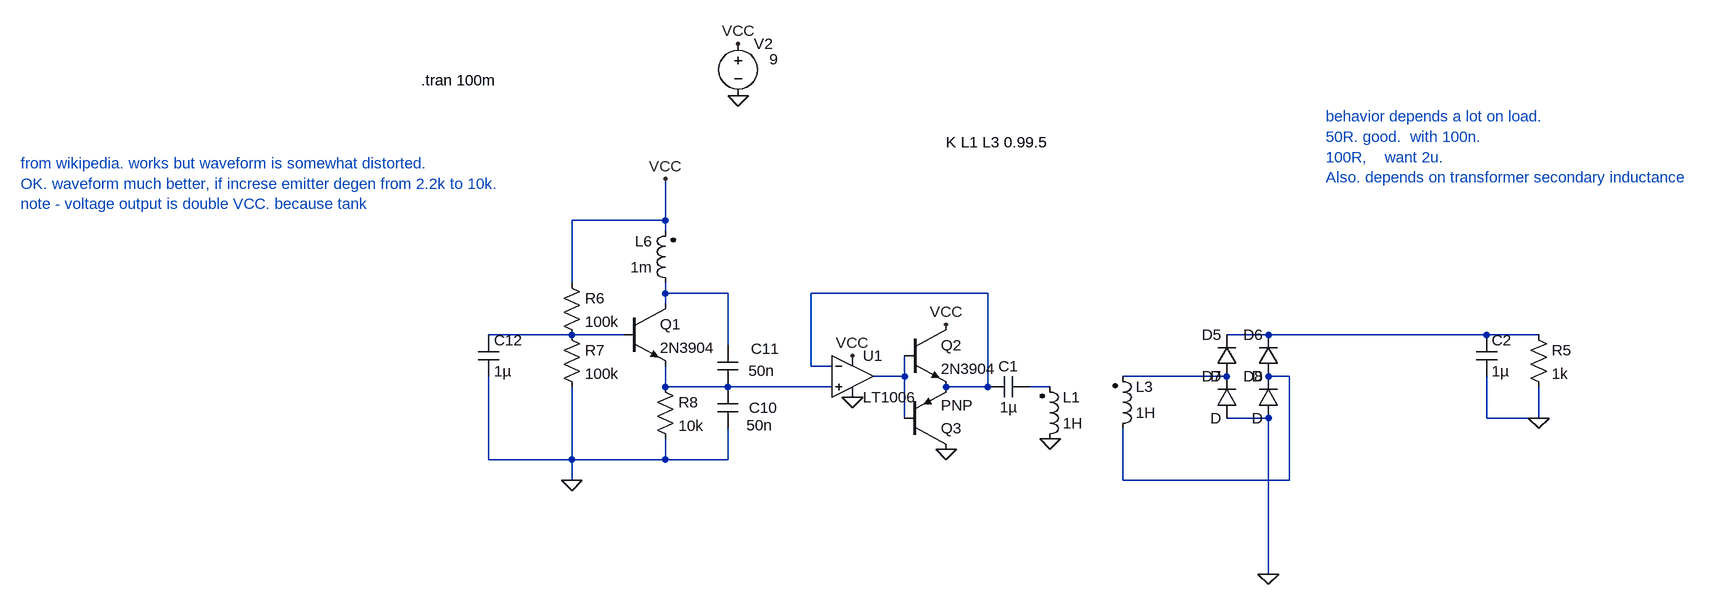
[diagram p0: schematic Draft105.asc]
Draft105.asc, the LTspice schematic file:
Version 4
SHEET 1 5720 1740
WIRE -992 -288 -992 -352
WIRE -992 -288 -1136 -288
WIRE -992 -272 -992 -288
WIRE -1136 -192 -1136 -288
WIRE -992 -176 -992 -192
WIRE -896 -176 -992 -176
WIRE -496 -176 -768 -176
WIRE -992 -160 -992 -176
WIRE -1136 -112 -1264 -112
WIRE -1056 -112 -1136 -112
WIRE -64 -112 -128 -112
WIRE 272 -112 -64 -112
WIRE 352 -112 272 -112
WIRE -896 -96 -896 -176
WIRE -768 -64 -768 -176
WIRE -736 -64 -768 -64
WIRE -624 -48 -624 -80
WIRE -624 -48 -672 -48
WIRE -128 -48 -288 -48
WIRE -32 -48 -64 -48
WIRE -992 -32 -992 -64
WIRE -896 -32 -992 -32
WIRE -736 -32 -896 -32
WIRE -496 -32 -496 -176
WIRE -496 -32 -560 -32
WIRE -400 -32 -432 -32
WIRE -624 16 -624 -48
WIRE -64 16 -128 16
WIRE 272 16 272 -48
WIRE 352 16 352 -32
WIRE 352 16 272 16
WIRE -1264 80 -1264 -48
WIRE -1136 80 -1136 -32
WIRE -1136 80 -1264 80
WIRE -992 80 -992 48
WIRE -992 80 -1136 80
WIRE -896 80 -896 32
WIRE -896 80 -992 80
WIRE -1136 112 -1136 80
WIRE -288 112 -288 32
WIRE -32 112 -32 -48
WIRE -32 112 -288 112
WIRE -64 256 -64 16
FLAG -880 -480 0
FLAG -880 -560 VCC
FLAG 352 16 0
FLAG -64 256 0
FLAG -992 -352 VCC
FLAG -1136 112 0
FLAG -400 48 0
FLAG -704 -80 VCC
FLAG -560 -128 VCC
FLAG -704 -16 0
FLAG -560 64 0
SYMBOL voltage -880 -576 R0
WINDOW 123 0 0 Left 0
WINDOW 39 0 0 Left 0
WINDOW 3 48 40 Left 2
SYMATTR Value 9
SYMATTR InstName V2
SYMBOL ind2 -304 48 M180
WINDOW 0 36 80 Left 2
WINDOW 3 36 40 Left 2
SYMATTR InstName L3
SYMATTR Value 1H
SYMATTR Type ind
SYMBOL diode -112 -48 R180
WINDOW 0 24 64 Left 2
WINDOW 3 24 0 Left 2
SYMATTR InstName D5
SYMBOL diode -48 -48 R180
WINDOW 0 24 64 Left 2
WINDOW 3 24 0 Left 2
SYMATTR InstName D6
SYMBOL diode -112 16 R180
WINDOW 0 24 64 Left 2
WINDOW 3 24 0 Left 2
SYMATTR InstName D7
SYMBOL diode -48 16 R180
WINDOW 0 24 64 Left 2
WINDOW 3 24 0 Left 2
SYMATTR InstName D8
SYMBOL cap 256 -112 R0
SYMATTR InstName C2
SYMATTR Value 1µ
SYMBOL res 336 -128 R0
SYMATTR InstName R5
SYMATTR Value 1k
SYMBOL ind2 -976 -176 R180
WINDOW 0 36 80 Left 2
WINDOW 3 36 40 Left 2
SYMATTR InstName L6
SYMATTR Value 1m
SYMATTR Type ind
SYMBOL res -1152 -208 R0
SYMATTR InstName R6
SYMATTR Value 100k
SYMBOL res -1152 -128 R0
SYMATTR InstName R7
SYMATTR Value 100k
SYMBOL npn -1056 -160 R0
SYMATTR InstName Q1
SYMATTR Value 2N3904
SYMBOL cap -912 -32 R0
WINDOW 0 49 32 Left 2
WINDOW 3 45 59 Left 2
SYMATTR InstName C10
SYMATTR Value 50n
SYMBOL cap -912 -96 R0
WINDOW 0 52 5 Left 2
WINDOW 3 48 39 Left 2
SYMATTR InstName C11
SYMATTR Value 50n
SYMBOL res -1008 -48 R0
SYMATTR InstName R8
SYMATTR Value 10k
SYMBOL cap -1280 -112 R0
SYMATTR InstName C12
SYMATTR Value 1µ
SYMBOL ind2 -416 64 M180
WINDOW 0 36 80 Left 2
WINDOW 3 36 40 Left 2
SYMATTR InstName L1
SYMATTR Value 1H
SYMATTR Type ind
SYMBOL cap -432 -48 R90
WINDOW 0 0 32 VBottom 2
WINDOW 3 32 32 VTop 2
SYMATTR InstName C1
SYMATTR Value 1µ
SYMBOL npn -624 -128 R0
SYMATTR InstName Q2
SYMATTR Value 2N3904
SYMBOL pnp -624 64 M180
SYMATTR InstName Q3
SYMBOL OpAmps\\LT1006 -704 -112 R0
SYMATTR InstName U1
TEXT -560 -408 Left 2 !K L1 L3 0.99.5
TEXT -1368 -504 Left 2 !.tran 100m
TEXT 24 -448 Left 2 ;behavior depends a lot on load. \n50R. good.  with 100n. \n100R,    want 2u.\nAlso. depends on transformer secondary inductance
TEXT -1984 -376 Left 2 ;from wikipedia. works but waveform is somewhat distorted.\nOK. waveform much better, if increse emitter degen from 2.2k to 10k.\nnote - voltage output is double VCC. because tank

The netlist it stands for:
* Draft105.asc
V2 VCC 0 9
L3 N007 N006 1H
D5 N006 N004 D
D6 N007 N004 D
D7 0 N006 D
D8 0 N007 D
C2 N004 0 1µ
R5 N004 0 1k
L6 N001 VCC 1m
R6 VCC N003 100k
R7 N003 0 100k
Q1 N001 N003 N008 0 2N3904
C10 N008 0 50n
C11 N001 N008 50n
R8 N008 0 10k
C12 N003 0 1µ
L1 0 N009 1H
C1 N009 N002 1µ
Q2 VCC N005 N002 0 2N3904
Q3 0 N005 N002 0 PNP
XU1 N008 N002 VCC 0 N005 LT1006  ; pins In+ In- V+ V- OUT
.model D D
.lib standard.dio
.model NPN NPN
.model PNP PNP
.lib standard.bjt
K L1 L3 0.99.5
.tran 100m
* behavior depends a lot on load.
* 50R. good.  with 100n.
* 100R,    want 2u.
* Also. depends on transformer secondary inductance
* from wikipedia. works but waveform is somewhat distorted.
* OK. waveform much better, if increse emitter degen from 2.2k to 10k.
* note - voltage output is double VCC. because tank
.lib LTC.lib
.backanno
.end